# EAGLE schematic HP-PowerBoard (EAGLE 7.5.0)
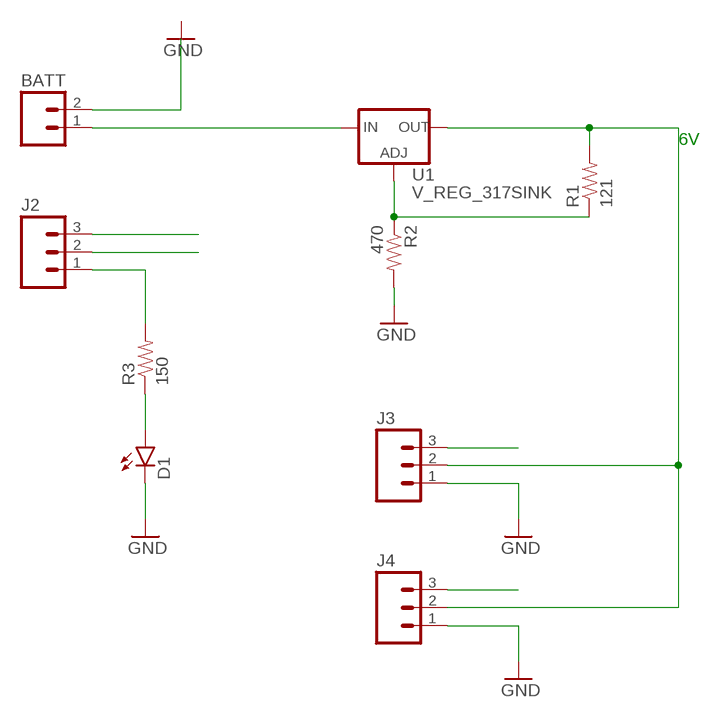
[diagram p0: schematic, sheet 1]

## Parts
BATT  M02JST-PTH-VERT  [JST-2-PTH-VERT]
D1  LED5MM  [LED5MM]
J2  M03PTH  [1X03]
J3  M03PTH  [1X03]
J4  M03PTH  [1X03]
R1  121  RESISTORPTH-1/4W  [AXIAL-0.4]
R2  470  RESISTORPTH-1/4W  [AXIAL-0.4]
R3  150  RESISTORPTH-1/4W  [AXIAL-0.4]
U1  V_REG_317SINK  [TO220-ADJ]

## Nets
GND: D1.K(C) J3.1 J4.1 R2.P$2
N$1: BATT.2
N$2: J2.1 R3.P$2
N$3: R1.P$1 R2.P$1 U1.ADJ
N$4: J4.2 R1.P$2 U1.OUT
N$5: D1.A R3.P$1
N$6: BATT.1 U1.IN
N$7: J2.3
N$8: J2.2
N$9: J3.3
N$11: J4.3
Unconnected: J3.2

## Notes on the sheet
- 6V

## Library data of the parts
BATT = SparkFun-Connectors:M02: Standard 2-pin 0.1" header. Use with - straight break away headers ( PRT-00116) - right angle break away headers (PRT-00553) - swiss pins (PRT-00743) - machine pins (PRT-00117) - female headers (PRT-00115) Molex polarized connector foot print use with: PRT-08233 with associated crimp pins and housings. 2.54_SCREWTERM for use with PRT-10571. 3.5mm Screw Terminal footprints for PRT-08084 5mm Screw Terminal footprints for use with PRT-08432
D1 = SparkFun-LED:LED: LEDs Standard schematic elements and footprints for 5mm, 3mm, 1206, and 0603 sized LEDs. 5mm - Spark Fun Electronics SKU : COM-00529 (and others)
J2-J4 = SparkFun-Connectors:M03: Header 3 Standard 3-pin 0.1" header. Use with straight break away headers (SKU : PRT-00116), right angle break away headers (PRT-00553), swiss pins (PRT-00743), machine pins (PRT-00117), and female headers (PRT-00115). Molex polarized connector foot print use with SKU : PRT-08232 with associated crimp pins and housings.
R1-R3 = SparkFun-Resistors:RESISTOR: Resistor Basic schematic elements and footprints for 0603, 1206, and PTH resistors.
U1 = SparkFun-PowerIC:V_REG_317: Voltage Regulator Standard LM317 adjustable voltage regulator. AOI (Adjust Output Input). Google 'LM317 Calculator' for easy to use app to get the two resistor values needed. 240/720 for 5V output. 240/390 for 3.3V output. Spark Fun Electronics SKU : COM-00527